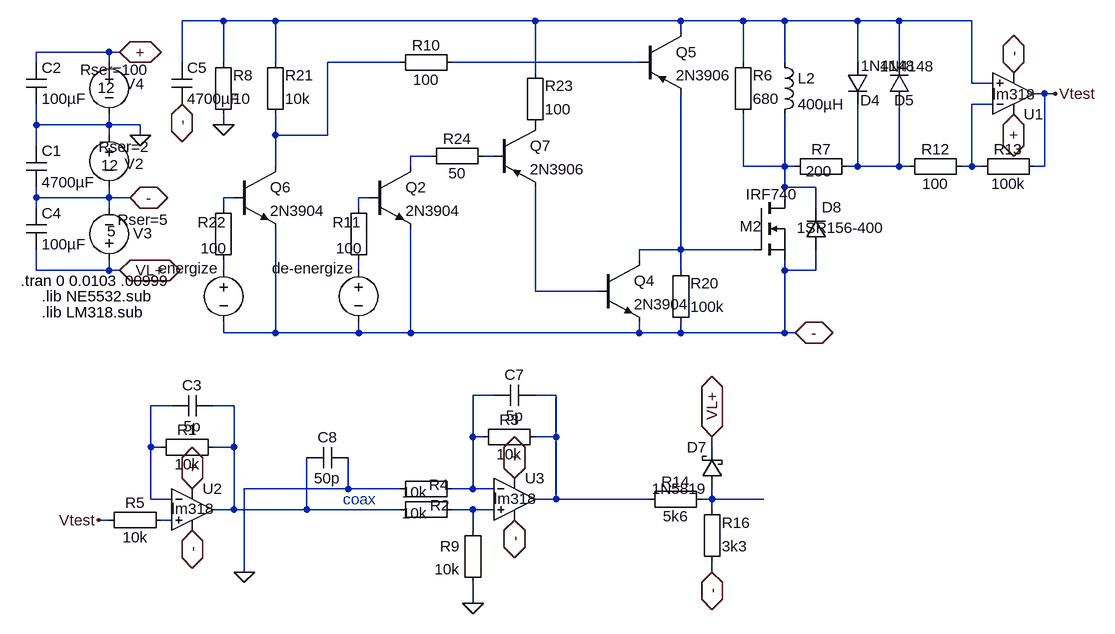
[diagram p0: schematic metal_low_power_fast_switch_4010.asc]
metal_low_power_fast_switch_4010.asc, the LTspice schematic file:
Version 4
SHEET 1 6068 1612
WIRE 96 -2400 32 -2400
WIRE 176 -2400 96 -2400
WIRE 576 -2400 176 -2400
WIRE 800 -2400 576 -2400
WIRE 896 -2400 800 -2400
WIRE 960 -2400 896 -2400
WIRE 1072 -2400 960 -2400
WIRE 1136 -2400 1072 -2400
WIRE 1248 -2400 1136 -2400
WIRE 800 -2384 800 -2400
WIRE -80 -2352 -192 -2352
WIRE -64 -2352 -80 -2352
WIRE -192 -2336 -192 -2352
WIRE -80 -2336 -80 -2352
WIRE 32 -2336 32 -2400
WIRE 96 -2336 96 -2400
WIRE 176 -2336 176 -2400
WIRE 368 -2336 256 -2336
WIRE 736 -2336 448 -2336
WIRE 896 -2336 896 -2400
WIRE 960 -2336 960 -2400
WIRE 1072 -2336 1072 -2400
WIRE 1136 -2336 1136 -2400
WIRE 576 -2320 576 -2400
WIRE 1248 -2304 1248 -2400
WIRE 1280 -2304 1248 -2304
WIRE 1360 -2288 1344 -2288
WIRE 1376 -2288 1360 -2288
WIRE 1280 -2272 1248 -2272
WIRE -192 -2240 -192 -2272
WIRE -80 -2240 -80 -2256
WIRE -80 -2240 -192 -2240
WIRE -32 -2240 -80 -2240
WIRE 96 -2240 96 -2256
WIRE -80 -2224 -80 -2240
WIRE -32 -2224 -32 -2240
WIRE 176 -2224 176 -2256
WIRE 256 -2224 256 -2336
WIRE 256 -2224 176 -2224
WIRE -192 -2208 -192 -2240
WIRE 416 -2192 384 -2192
WIRE 512 -2192 496 -2192
WIRE 176 -2176 176 -2224
WIRE 384 -2176 384 -2192
WIRE 896 -2176 896 -2256
WIRE 960 -2176 960 -2256
WIRE 960 -2176 896 -2176
WIRE 976 -2176 960 -2176
WIRE 1072 -2176 1072 -2272
WIRE 1072 -2176 1056 -2176
WIRE 1136 -2176 1136 -2272
WIRE 1136 -2176 1072 -2176
WIRE 1152 -2176 1136 -2176
WIRE 1248 -2176 1248 -2272
WIRE 1248 -2176 1232 -2176
WIRE 1264 -2176 1248 -2176
WIRE 1360 -2176 1360 -2288
WIRE 1360 -2176 1344 -2176
WIRE 960 -2144 960 -2176
WIRE 1008 -2144 960 -2144
WIRE -192 -2128 -192 -2144
WIRE -80 -2128 -80 -2144
WIRE -80 -2128 -192 -2128
WIRE -48 -2128 -80 -2128
WIRE 112 -2128 96 -2128
WIRE 320 -2128 304 -2128
WIRE 960 -2128 960 -2144
WIRE -192 -2112 -192 -2128
WIRE -80 -2112 -80 -2128
WIRE 96 -2112 96 -2128
WIRE 304 -2112 304 -2128
WIRE 1008 -2112 1008 -2144
WIRE 800 -2048 800 -2288
WIRE 800 -2048 736 -2048
WIRE 912 -2048 800 -2048
WIRE 736 -2032 736 -2048
WIRE -192 -2016 -192 -2048
WIRE -80 -2016 -80 -2032
WIRE -80 -2016 -192 -2016
WIRE -64 -2016 -80 -2016
WIRE 96 -2016 96 -2032
WIRE 304 -2016 304 -2032
WIRE 800 -2016 800 -2048
WIRE 960 -2016 960 -2032
WIRE 1008 -2016 1008 -2048
WIRE 1008 -2016 960 -2016
WIRE 576 -1984 576 -2144
WIRE 672 -1984 576 -1984
WIRE 96 -1920 96 -1936
WIRE 176 -1920 176 -2080
WIRE 176 -1920 96 -1920
WIRE 304 -1920 304 -1936
WIRE 304 -1920 176 -1920
WIRE 384 -1920 384 -2080
WIRE 384 -1920 304 -1920
WIRE 736 -1920 736 -1936
WIRE 736 -1920 384 -1920
WIRE 800 -1920 800 -1936
WIRE 800 -1920 736 -1920
WIRE 960 -1920 960 -2016
WIRE 960 -1920 800 -1920
WIRE 976 -1920 960 -1920
WIRE 512 -1824 480 -1824
WIRE 608 -1824 576 -1824
WIRE 16 -1808 -16 -1808
WIRE 112 -1808 80 -1808
WIRE 480 -1760 480 -1824
WIRE 496 -1760 480 -1760
WIRE 608 -1760 608 -1824
WIRE 608 -1760 576 -1760
WIRE -16 -1744 -16 -1808
WIRE 0 -1744 -16 -1744
WIRE 112 -1744 112 -1808
WIRE 112 -1744 80 -1744
WIRE 848 -1744 848 -1760
WIRE 288 -1680 288 -1728
WIRE 288 -1680 128 -1680
WIRE 368 -1680 288 -1680
WIRE 480 -1680 480 -1760
WIRE 480 -1680 448 -1680
WIRE 512 -1680 480 -1680
WIRE -16 -1664 -16 -1744
WIRE 16 -1664 -16 -1664
WIRE 608 -1664 608 -1760
WIRE 608 -1664 576 -1664
WIRE 752 -1664 608 -1664
WIRE 848 -1664 848 -1680
WIRE 848 -1664 832 -1664
WIRE 928 -1664 848 -1664
WIRE 112 -1648 112 -1744
WIRE 112 -1648 80 -1648
WIRE 224 -1648 224 -1728
WIRE 224 -1648 112 -1648
WIRE 368 -1648 224 -1648
WIRE 480 -1648 448 -1648
WIRE 512 -1648 480 -1648
WIRE 848 -1648 848 -1664
WIRE -80 -1632 -96 -1632
WIRE 16 -1632 0 -1632
WIRE 480 -1616 480 -1648
WIRE 128 -1552 128 -1680
WIRE 848 -1552 848 -1568
WIRE 480 -1504 480 -1536
FLAG -48 -2128 -
IOPIN -48 -2128 BiDir
FLAG -64 -2352 +
IOPIN -64 -2352 BiDir
FLAG -32 -2224 0
FLAG -64 -2016 VL+
IOPIN -64 -2016 BiDir
FLAG 32 -2272 -
IOPIN 32 -2272 BiDir
FLAG 96 -2240 0
FLAG 1312 -2256 +
IOPIN 1312 -2256 BiDir
FLAG 1312 -2320 -
IOPIN 1312 -2320 BiDir
FLAG 848 -1552 -
IOPIN 848 -1552 BiDir
FLAG 848 -1760 VL+
IOPIN 848 -1760 BiDir
FLAG 976 -1920 -
IOPIN 976 -1920 BiDir
FLAG 48 -1680 +
IOPIN 48 -1680 BiDir
FLAG 48 -1616 -
IOPIN 48 -1616 BiDir
FLAG 544 -1696 +
IOPIN 544 -1696 BiDir
FLAG 544 -1632 -
IOPIN 544 -1632 BiDir
FLAG 1376 -2288 Vtest
FLAG -96 -1632 Vtest
FLAG 480 -1504 0
FLAG 128 -1552 0
SYMBOL voltage -80 -2240 M0
WINDOW 123 0 0 Left 2
WINDOW 39 -63 34 Left 2
WINDOW 0 -53 60 Left 2
WINDOW 3 -15 62 Left 2
SYMATTR SpiceLine Rser=2
SYMATTR InstName V2
SYMATTR Value 12
SYMBOL voltage -80 -2352 M0
WINDOW 123 0 0 Left 2
WINDOW 39 -61 27 Left 2
WINDOW 0 -54 49 Left 2
WINDOW 3 -9 55 Left 2
SYMATTR SpiceLine Rser=100
SYMATTR InstName V4
SYMATTR Value 12
SYMBOL voltage -80 -2016 M180
WINDOW 123 0 0 Left 2
WINDOW 39 13 78 Left 2
WINDOW 0 37 57 Left 2
WINDOW 3 -3 60 Left 2
SYMATTR SpiceLine Rser=5
SYMATTR InstName V3
SYMATTR Value 5
SYMBOL Misc\\EuropeanCap -208 -2208 R0
SYMATTR InstName C1
SYMATTR Value 4700µF
SYMATTR SpiceLine V=400 Irms=1 Rser=.32 Lser=0
SYMBOL Misc\\EuropeanCap -208 -2336 R0
SYMATTR InstName C2
SYMATTR Value 100µF
SYMATTR SpiceLine V=400 Irms=1 Rser=.32 Lser=0
SYMBOL Misc\\EuropeanCap -208 -2112 R0
SYMATTR InstName C4
SYMATTR Value 100µF
SYMATTR SpiceLine V=400 Irms=1 Rser=.32 Lser=0
SYMBOL Misc\\EuropeanCap 16 -2336 R0
SYMATTR InstName C5
SYMATTR Value 4700µF
SYMATTR SpiceLine V=400 Irms=1 Rser=.32 Lser=0
SYMBOL ind 944 -2352 R0
SYMATTR InstName L2
SYMATTR Value 400µH
SYMATTR SpiceLine Rser=.5 Cpar=200p
SYMBOL Misc\\EuropeanResistor 880 -2240 M180
WINDOW 0 31 76 Left 2
WINDOW 3 31 40 Left 2
SYMATTR InstName R6
SYMATTR Value 680
SYMBOL Misc\\EuropeanResistor 960 -2192 M90
WINDOW 0 5 56 VBottom 2
WINDOW 3 8 53 VTop 2
SYMATTR InstName R7
SYMATTR Value 200
SYMBOL diode 1056 -2336 R0
WINDOW 3 21 5 Left 2
WINDOW 0 20 58 Left 2
SYMATTR Value 1N4148
SYMATTR InstName D4
SYMBOL diode 1152 -2272 R180
WINDOW 0 -7 6 Left 2
WINDOW 3 -39 58 Left 2
SYMATTR InstName D5
SYMATTR Value 1N4148
SYMBOL Misc\\EuropeanResistor 80 -2240 M180
WINDOW 0 31 76 Left 2
WINDOW 3 31 40 Left 2
SYMATTR InstName R8
SYMATTR Value 10
SYMBOL nmos 912 -2128 R0
WINDOW 0 -21 44 Left 2
WINDOW 3 -12 -5 Left 2
SYMATTR InstName M2
SYMATTR Value IRF740
SYMBOL voltage 304 -2032 M0
WINDOW 0 5 13 Left 2
WINDOW 3 -134 119 Invisible 2
WINDOW 123 0 0 Left 2
SYMATTR InstName de-energize
SYMATTR Value PULSE(0 4.8 .01015 0 0 .00001 .01 1000)
SYMATTR SpiceLine Rser=0
SYMBOL npn3 320 -2176 R0
SYMATTR InstName Q2
SYMATTR Value 2N3904
SYMBOL Misc\\EuropeanResistor 288 -2016 M180
WINDOW 0 -24 74 Left 2
WINDOW 3 -19 34 Left 2
SYMATTR InstName R11
SYMATTR Value 100
SYMBOL Opamps\\opamp2 1312 -2224 M180
WINDOW 3 -32 63 Left 2
SYMATTR Value lm318
SYMATTR InstName U1
SYMBOL Misc\\EuropeanResistor 1136 -2160 R270
WINDOW 0 27 56 VTop 2
WINDOW 3 5 56 VBottom 2
SYMATTR InstName R12
SYMATTR Value 100
SYMBOL Misc\\EuropeanResistor 1248 -2160 R270
WINDOW 0 27 56 VTop 2
WINDOW 3 5 56 VBottom 2
SYMATTR InstName R13
SYMATTR Value 100k
SYMBOL Misc\\EuropeanResistor 736 -1648 R270
WINDOW 0 27 56 VTop 2
WINDOW 3 5 56 VBottom 2
SYMATTR InstName R14
SYMATTR Value 5k6
SYMBOL Misc\\EuropeanResistor 832 -1552 M180
WINDOW 0 31 76 Left 2
WINDOW 3 31 40 Left 2
SYMATTR InstName R16
SYMATTR Value 3k3
SYMBOL schottky 864 -1680 R180
WINDOW 0 24 64 Left 2
WINDOW 3 24 0 Left 2
SYMATTR InstName D7
SYMATTR Value 1N5819
SYMATTR Description Diode
SYMATTR Type diode
SYMBOL npn3 672 -2032 R0
SYMATTR InstName Q4
SYMATTR Value 2N3904
SYMBOL diode 1024 -2048 R180
WINDOW 0 -24 65 Left 2
WINDOW 3 -90 34 Left 2
SYMATTR InstName D8
SYMATTR Value 1SR156-400
SYMATTR Description Zener Diode
SYMATTR Type zener
SYMBOL pnp2 736 -2384 R0
SYMATTR InstName Q5
SYMATTR Value 2N3906
SYMBOL Misc\\EuropeanResistor 784 -1920 M180
WINDOW 0 31 76 Left 2
WINDOW 3 31 40 Left 2
SYMATTR InstName R20
SYMATTR Value 100k
SYMBOL voltage 96 -2032 M0
WINDOW 0 7 13 Left 2
WINDOW 3 -134 119 Invisible 2
WINDOW 123 0 0 Left 2
SYMATTR InstName energize
SYMATTR Value PULSE(0 4.8 .01 0 0 .00012 .01 1000)
SYMATTR SpiceLine Rser=0
SYMBOL npn3 112 -2176 R0
SYMATTR InstName Q6
SYMATTR Value 2N3904
SYMBOL Misc\\EuropeanResistor 160 -2240 M180
WINDOW 0 31 76 Left 2
WINDOW 3 31 40 Left 2
SYMATTR InstName R21
SYMATTR Value 10k
SYMBOL Misc\\EuropeanResistor 80 -2016 M180
WINDOW 0 -24 74 Left 2
WINDOW 3 -19 34 Left 2
SYMATTR InstName R22
SYMATTR Value 100
SYMBOL Misc\\EuropeanResistor 352 -2352 M90
WINDOW 0 5 56 VBottom 2
WINDOW 3 27 56 VTop 2
SYMATTR InstName R10
SYMATTR Value 100
SYMBOL pnp2 512 -2240 R0
SYMATTR InstName Q7
SYMATTR Value 2N3906
SYMBOL Misc\\EuropeanResistor 560 -2224 M180
WINDOW 0 31 76 Left 2
WINDOW 3 31 40 Left 2
SYMATTR InstName R23
SYMATTR Value 100
SYMBOL Misc\\EuropeanResistor 400 -2208 M90
WINDOW 0 5 56 VBottom 2
WINDOW 3 27 56 VTop 2
SYMATTR InstName R24
SYMATTR Value 50
SYMBOL Opamps\\opamp2 48 -1712 R0
WINDOW 3 -32 63 Left 2
SYMATTR Value lm318
SYMATTR InstName U2
SYMBOL Misc\\EuropeanResistor -16 -1760 M90
WINDOW 0 5 56 VBottom 2
WINDOW 3 27 56 VTop 2
SYMATTR InstName R1
SYMATTR Value 10k
SYMBOL Misc\\EuropeanCap 80 -1792 M270
WINDOW 0 32 32 VTop 2
WINDOW 3 0 32 VBottom 2
SYMATTR InstName C3
SYMATTR Value 5p
SYMATTR SpiceLine V=400 Irms=1 Rser=.32 Lser=0
SYMBOL Opamps\\opamp2 544 -1728 R0
WINDOW 3 -32 63 Left 2
SYMATTR Value lm318
SYMATTR InstName U3
SYMBOL Misc\\EuropeanResistor 480 -1776 M90
WINDOW 0 5 56 VBottom 2
WINDOW 3 27 56 VTop 2
SYMATTR InstName R3
SYMATTR Value 10k
SYMBOL Misc\\EuropeanCap 576 -1808 M270
WINDOW 0 32 32 VTop 2
WINDOW 3 0 32 VBottom 2
SYMATTR InstName C7
SYMATTR Value 5p
SYMATTR SpiceLine V=400 Irms=1 Rser=.32 Lser=0
SYMBOL Misc\\EuropeanCap 288 -1712 M270
WINDOW 0 32 32 VTop 2
WINDOW 3 0 32 VBottom 2
SYMATTR InstName C8
SYMATTR Value 50p
SYMATTR SpiceLine V=400 Irms=1 Rser=.32 Lser=0
SYMBOL Misc\\EuropeanResistor 352 -1664 M90
WINDOW 0 25 77 VBottom 2
WINDOW 3 6 38 VTop 2
SYMATTR InstName R2
SYMATTR Value 10k
SYMBOL Misc\\EuropeanResistor -96 -1648 M90
WINDOW 0 5 56 VBottom 2
WINDOW 3 27 56 VTop 2
SYMATTR InstName R5
SYMATTR Value 10k
SYMBOL Misc\\EuropeanResistor 496 -1632 M0
SYMATTR InstName R9
SYMATTR Value 10k
SYMBOL Misc\\EuropeanResistor 352 -1696 M90
WINDOW 0 25 76 VBottom 2
WINDOW 3 6 38 VTop 2
SYMATTR InstName R4
SYMATTR Value 10k
TEXT -216 -2000 Left 2 !.tran 0 0.0103 .00999
TEXT -184 -1976 Left 2 !.lib NE5532.sub
TEXT -184 -1952 Left 2 !.lib LM318.sub
TEXT 280 -1664 Left 2 ;coax

The netlist it stands for:
* metal_low_power_fast_switch_4010.asc
V2 0 - 12 Rser=2
V4 + 0 12 Rser=100
V3 VL+ - 5 Rser=5
C1 0 - 4700µF V=400 Irms=1 Rser=.32 Lser=0
C2 + 0 100µF V=400 Irms=1 Rser=.32 Lser=0
C4 - VL+ 100µF V=400 Irms=1 Rser=.32 Lser=0
C5 N001 - 4700µF V=400 Irms=1 Rser=.32 Lser=0
L2 N001 N007 400µH Rser=.5 Cpar=200p
R6 N007 N001 680
R7 N007 N008 200
D4 N001 N008 1N4148
D5 N008 N001 1N4148
R8 0 N001 10
M2 N007 N011 - - IRF740
V§de-energize N013 - PULSE(0 4.8 .01015 0 0 .00001 .01 1000) Rser=0
Q2 N005 N010 - 0 2N3904
R11 N013 N010 100
XU1 N001 N004 + - Vtest lm318  ; pins In+ In- V+ V- OUT
R12 N008 N004 100
R13 N004 Vtest 100k
R14 N016 N019 5k6
R16 - N019 3k3
D7 N019 VL+ 1N5819
Q4 N011 N014 - 0 2N3904
D8 - N007 1SR156-400
Q5 N001 N003 N011 0 2N3906
R20 - N011 100k
V§energize N012 - PULSE(0 4.8 .01 0 0 .00012 .01 1000) Rser=0
Q6 N002 N009 - 0 2N3904
R21 N002 N001 10k
R22 N012 N009 100
R10 N002 N003 100
Q7 P001 N006 N014 0 2N3906
R23 P001 N001 100
R24 N005 N006 50
XU2 N021 N017 + - N018 lm318  ; pins In+ In- V+ V- OUT
R1 N017 N018 10k
C3 N018 N017 5p V=400 Irms=1 Rser=.32 Lser=0
XU3 N020 N015 + - N016 lm318  ; pins In+ In- V+ V- OUT
R3 N015 N016 10k
C7 N016 N015 5p V=400 Irms=1 Rser=.32 Lser=0
C8 0 N018 50p V=400 Irms=1 Rser=.32 Lser=0
R2 N018 N020 10k
R5 Vtest N021 10k
R9 N020 0 10k
R4 0 N015 10k
.model D D
.lib standard.dio
.model NPN NPN
.model PNP PNP
.lib standard.bjt
.model NMOS NMOS
.model PMOS PMOS
.lib standard.mos
.tran 0 0.0103 .00999
.lib NE5532.sub
.lib LM318.sub
* coax
.backanno
.end